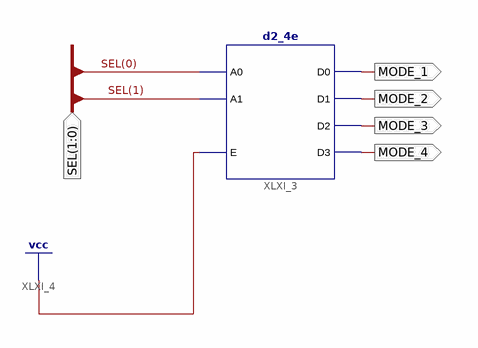
[diagram p0: schematic sheet 1]
// Xilinx ISE schematic ModeController.sch (spartan6) as structural Verilog: 1 symbols, 5 ports
module ModeController (
  input  [1:0] SEL,
  output MODE_1,
  output MODE_3,
  output MODE_2,
  output MODE_4
);

  d2_4e XLXI_3 (.A0(SEL[0]), .A1(SEL[1]), .E(1'b1), .D0(MODE_1), .D1(MODE_2), .D2(MODE_3), .D3(MODE_4));
endmodule
